# Altium schematic sheet W5500.SchDoc
size A4; SheetNumber: 5; SheetTotal: 8
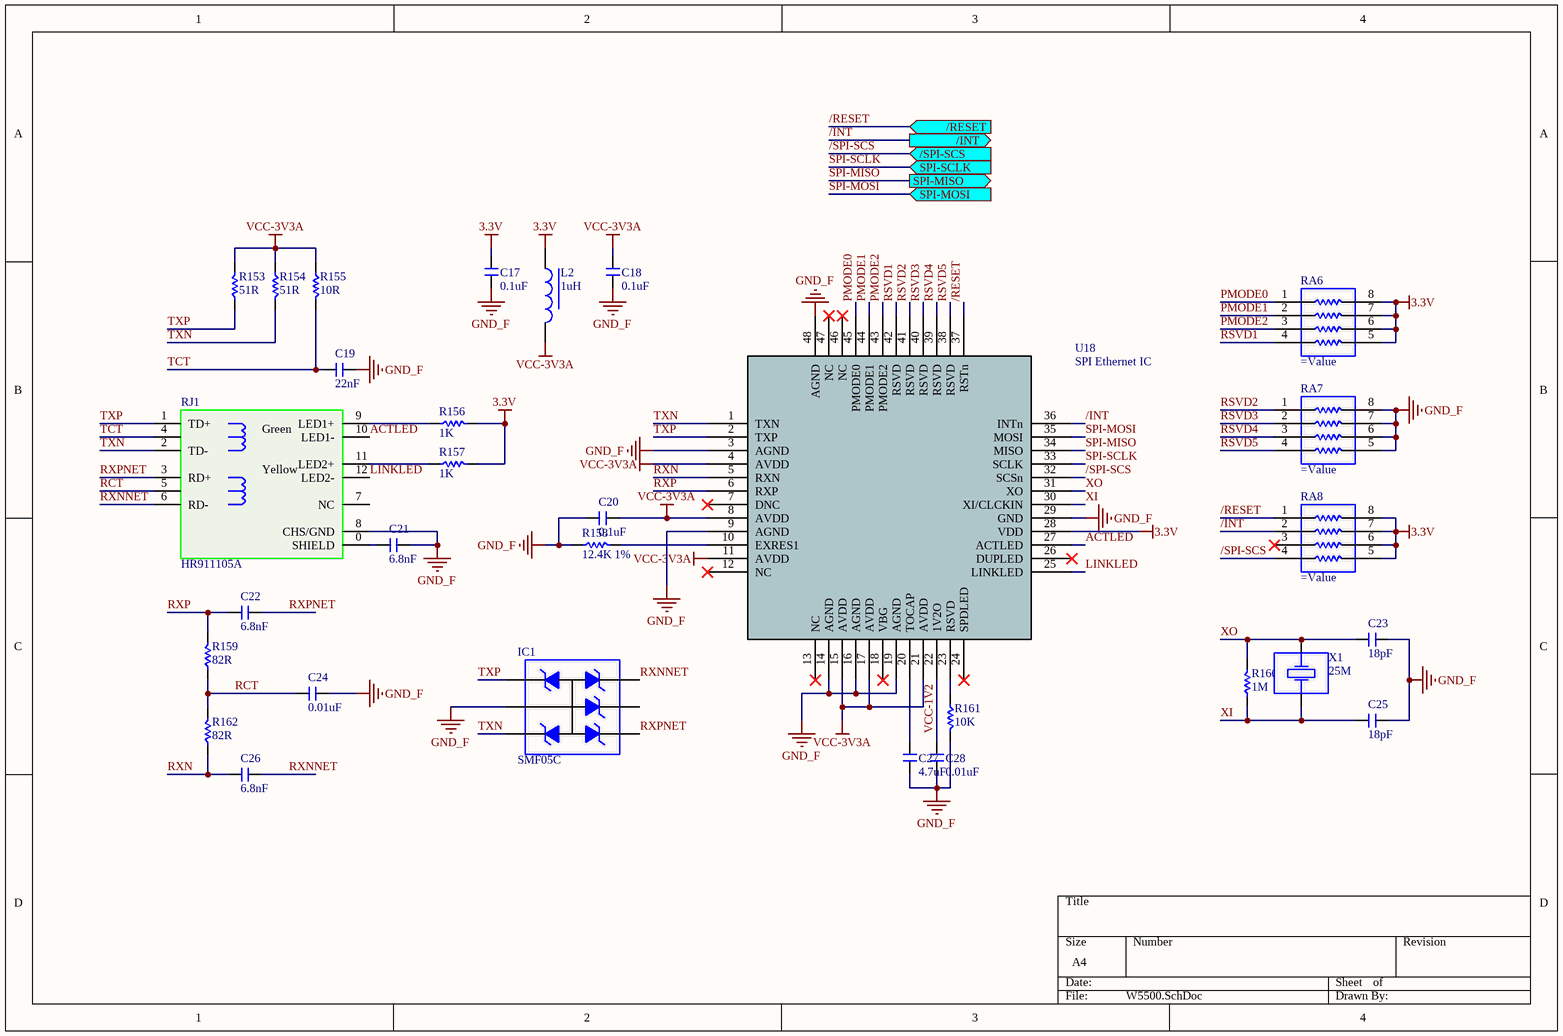
[diagram p0: W5500.SchDoc]

## Parts
C17  0.1uF  [C 0805]
C18  0.1uF  [C 0805]
C19  22nF  [C 0805]
C20  0.1uF  [C 0805]
C21  6.8nF  [C 0805]
C22  6.8nF  [C 0805]
C23  18pF  [C 0805]
C24  0.01uF  [C 0805]
C25  18pF  [C 0805]
C26  6.8nF  [C 0805]
C27  4.7uF  [C 0805]
C28  0.01uF  [C 0805]
IC1  SMF05C  [SOT23-6L]
L2  1uH  [L 0805]
R153  51R  [R 0805]
R154  51R  [R 0805]
R155  10R  [R 0805]
R156  1K  [R 0805]
R157  1K  [R 0805]
R158  12.4K 1%  [R 0805]
R159  82R  [R 0805]
R160  1M  [R 0805]
R161  10K  [R 0805]
R162  82R  [R 0805]
RA6  (no value)  [RA1206 (4x0603)]
RA7  (no value)  [RA1206 (4x0603)]
RA8  (no value)  [RA1206 (4x0603)]
RJ1  HR911105A  [RJ-45A12]
U18  SPI Ethernet IC  [LQFP48 7X7_L]
X1  25M  [XTAL-HC49S-THD]

## Ports
/INT (out), /RESET (in), /SPI-SCS (in), SPI-MISO (out), SPI-MOSI (in), SPI-SCLK (in)

## Nets
3.3V: C17.2 L2.1 R156.2 R157.2 RA6.5 RA6.6 RA6.7 RA6.8 RA8.5 RA8.6 RA8.7 RA8.8 U18.28(VDD)
GND_F: C17.1 C18.1 C19.2 C20.1 C21.2 C23.2 C24.2 C25.2 C27.2 C28.2 IC1.2(A) R158.1 R161.2 RA7.5 RA7.6 RA7.7 RA7.8 RJ1.8(CHS/GND) U18.3(AGND) U18.9(AGND) U18.14(AGND) U18.16(AGND) U18.19(AGND) U18.29(GND) U18.48(AGND)
VCC-3V3A: C18.2 C20.2 L2.2 R153.2 R154.1 R155.1 U18.4(AVDD) U18.8(AVDD) U18.11(AVDD) U18.15(AVDD) U18.17(AVDD) U18.21(AVDD)
/INT: RA8.2 U18.36(INTn) ; port /INT
/RESET: RA8.1 U18.37(RSTn) ; port /RESET
/SPI-SCS: RA8.4 U18.32(SCSn) ; port /SPI-SCS
ACTLED: RJ1.10(LED1-) U18.27(ACTLED)
LINKLED: RJ1.12(LED2-) U18.25(LINKLED)
PMODE0: RA6.1 U18.45(PMODE0)
PMODE1: RA6.2 U18.44(PMODE1)
PMODE2: RA6.3 U18.43(PMODE2)
RCT: C24.1 R159.1 R162.2 RJ1.5
RSVD1: RA6.4 U18.42(RSVD)
RSVD2: RA7.1 U18.41(RSVD)
RSVD3: RA7.2 U18.40(RSVD)
RSVD4: RA7.3 U18.39(RSVD)
RSVD5: RA7.4 U18.38(RSVD)
RXN: C26.1 R162.1 U18.5(RXN)
RXNNET: C26.2 IC1.4(K) RJ1.6(RD-)
RXP: C22.1 R159.2 U18.6(RXP)
RXPNET: C22.2 IC1.6(K) RJ1.3(RD+)
SPI-MISO: U18.34(MISO) ; port SPI-MISO
SPI-MOSI: U18.35(MOSI) ; port SPI-MOSI
SPI-SCLK: U18.33(SCLK) ; port SPI-SCLK
TCT: C19.1 R155.2 RJ1.4
TXN: IC1.3(K) R154.2 RJ1.2(TD-) U18.1(TXN)
TXP: IC1.1(K) R153.1 RJ1.1(TD+) U18.2(TXP)
VCC-1V2: C28.1 U18.22(1V2O)
XI: C25.1 R160.1 U18.30(XI/CLCKIN) X1.1
XO: C23.1 R160.2 U18.31(XO) X1.2
NetC21_1: C21.1 RJ1.0(SHIELD)
NetC27_1: C27.1 U18.20(TOCAP)
NetR156_1: R156.1 RJ1.9(LED1+)
NetR157_1: R157.1 RJ1.11(LED2+)
NetR158_2: R158.2 U18.10(EXRES1)
NetR161_1: R161.1 U18.23(RSVD)

Not connected (* = marked no-connect by the designer): IC1 5(K); RA8 3*; RJ1 7(NC); U18 7(DNC)* 12(NC)* 13(NC)* 18(VBG)* 24(SPDLED)* 26(DUPLED)* 46(NC)* 47(NC)*

## Notes on the sheet
- (in symbol HR911105A) Green; Yellow

## Library data of the parts
C17-C28 = C: Non-polar patch capacitor; BOM名称: 无极性贴片电容; 版权归属: 源创客; 学习资源: www.ooocke.com
IC1 = SMF05C: ESD Protection Diode Array, 5-Line
L2 = L: Low power chip inductor; BOM名称: 小功率贴片电感; 版权归属: 源创客; 学习资源: www.ooocke.com
R153-R162 = R: Chip resistor; 版权归属: 源创客; BOM名称: Chip resistor; 学习资源: www.ooocke.com
RA6-RA8 = R-ARR: 4 way Chip Resistor Array
RJ1 = HR911105A: Illuminated Ethernet interface; BOM名称: 带灯以太网接口; 版权归属: 源创客; 学习资源: www.ooocke.com
U18 = W5500
X1 = XTAL-2: 2-Pin crystal; BOM名称: 2脚晶振; 版权归属: 源创客; 学习资源: www.ooocke.com